# Altium schematic sheet CAN_MAX3051.SchDoc
size A4
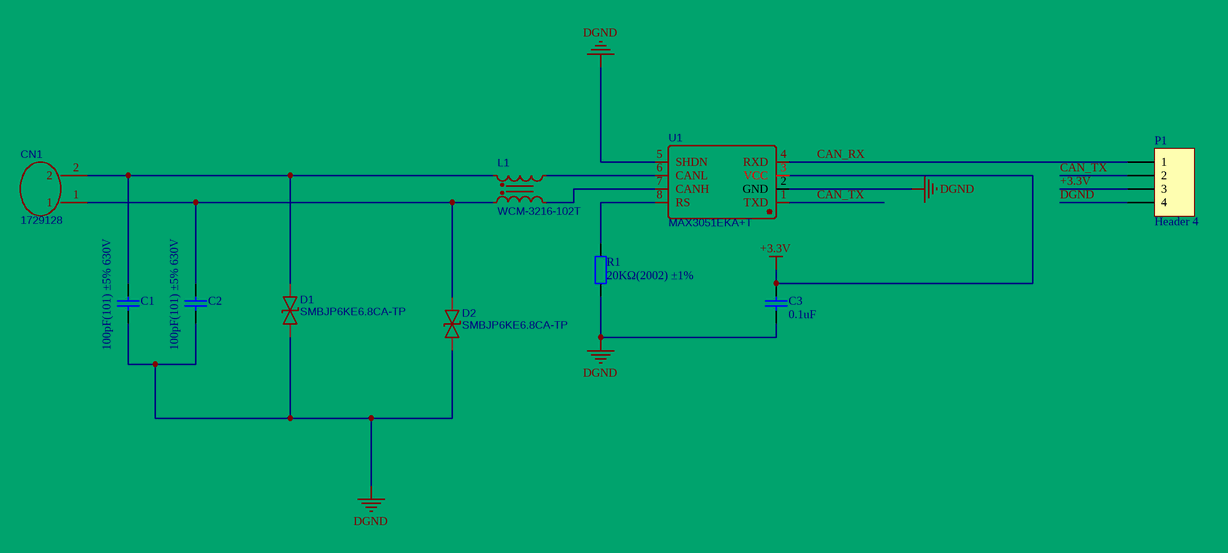
[diagram p0: CAN_MAX3051.SchDoc]

## Parts
C1  100pF(101) ±5% 630V  [0805_C]
C2  100pF(101) ±5% 630V  [0805_C]
C3  0.1uF  [0805_C]
CN1  1729128  [CONN-TH_2P-P5.08_1714984]
D1  SMBJP6KE6.8CA-TP  [SMB_L4.6-W3.6-LS5.3-BI]
D2  SMBJP6KE6.8CA-TP  [SMB_L4.6-W3.6-LS5.3-BI]
L1  WCM-3216-102T  [FILTER-SMD_1206-4P-L3.2-W1.6-BL-CW]
P1  Header 4  [HDR1X4]
R1  20KΩ(2002) ±1%  [0805_R]
U1  MAX3051EKA+T  [SOT-23-8_L3.0-W1.7-P0.65-LS2.8-TL]

## Nets
+3.3V: C3.2 P1.3 U1.3(VCC)
DGND: C1.1 C2.1 C3.1 D1.1 D2.1 P1.4 R1.1 U1.2(GND) U1.5(SHDN)
CAN_RX: P1.1 U1.4(RXD)
CAN_TX: P1.2 U1.1(TXD)
NetC1_2: C1.2 CN1.2 D1.2 L1.1
NetC2_2: C2.2 CN1.1 D2.2 L1.2
NetL1_3: L1.3 U1.7(CANH)
NetL1_4: L1.4 U1.6(CANL)
NetR1_2: R1.2 U1.8(RS)

## Library data of the parts
C1 C2 = 0805 1uF (105) 10% 50V: 贴片电容; BOM_Manufacturer: muRata; BOM_Manufacturer Part: GRM21A5C2J101JWA1D; Package: 0805
C3 = 0805 1uF (105) 10% 50V: 贴片电容; Package: 0805; Supplier: muRata; SuppliersPartNumber: GCM21BR72A104KA37L
CN1 = MKDSN1.5/2-5.08: BOM_Manufacturer: Phoenix Contact; BOM_Manufacturer Part: 1729128
D1 D2 = SMBJP6KE6.8CA-TP: BOM_Manufacturer: MCC(Micro Commercial Components); BOM_Manufacturer Part: SMBJP6KE6.8CA-TP; Package: SMB
L1 = WCM-3216-102T: BOM_Manufacturer: Kingcore; 可更换为: CC1812C513R-10; BOM_Manufacturer Part: WCM-3216-102T
P1 = Header 4: Header, 4-Pin; LatestRevisionDate: 17-Jul-2002; LatestRevisionNote: Re-released for DXP Platform.; Publisher: Altium Limited
R1 = 0805 1KΩ (1001) 1%: 贴片电阻; BOM_Manufacturer: ROHM; BOM_Manufacturer Part: MCR10EZPF2002; Package: 0805
U1 = MAX3051EKA: BOM_Manufacturer: MAXIM; BOM_Manufacturer Part: MAX3051EKA+T